# Altium project Zotino.PrjPCB (part 1 of 2)
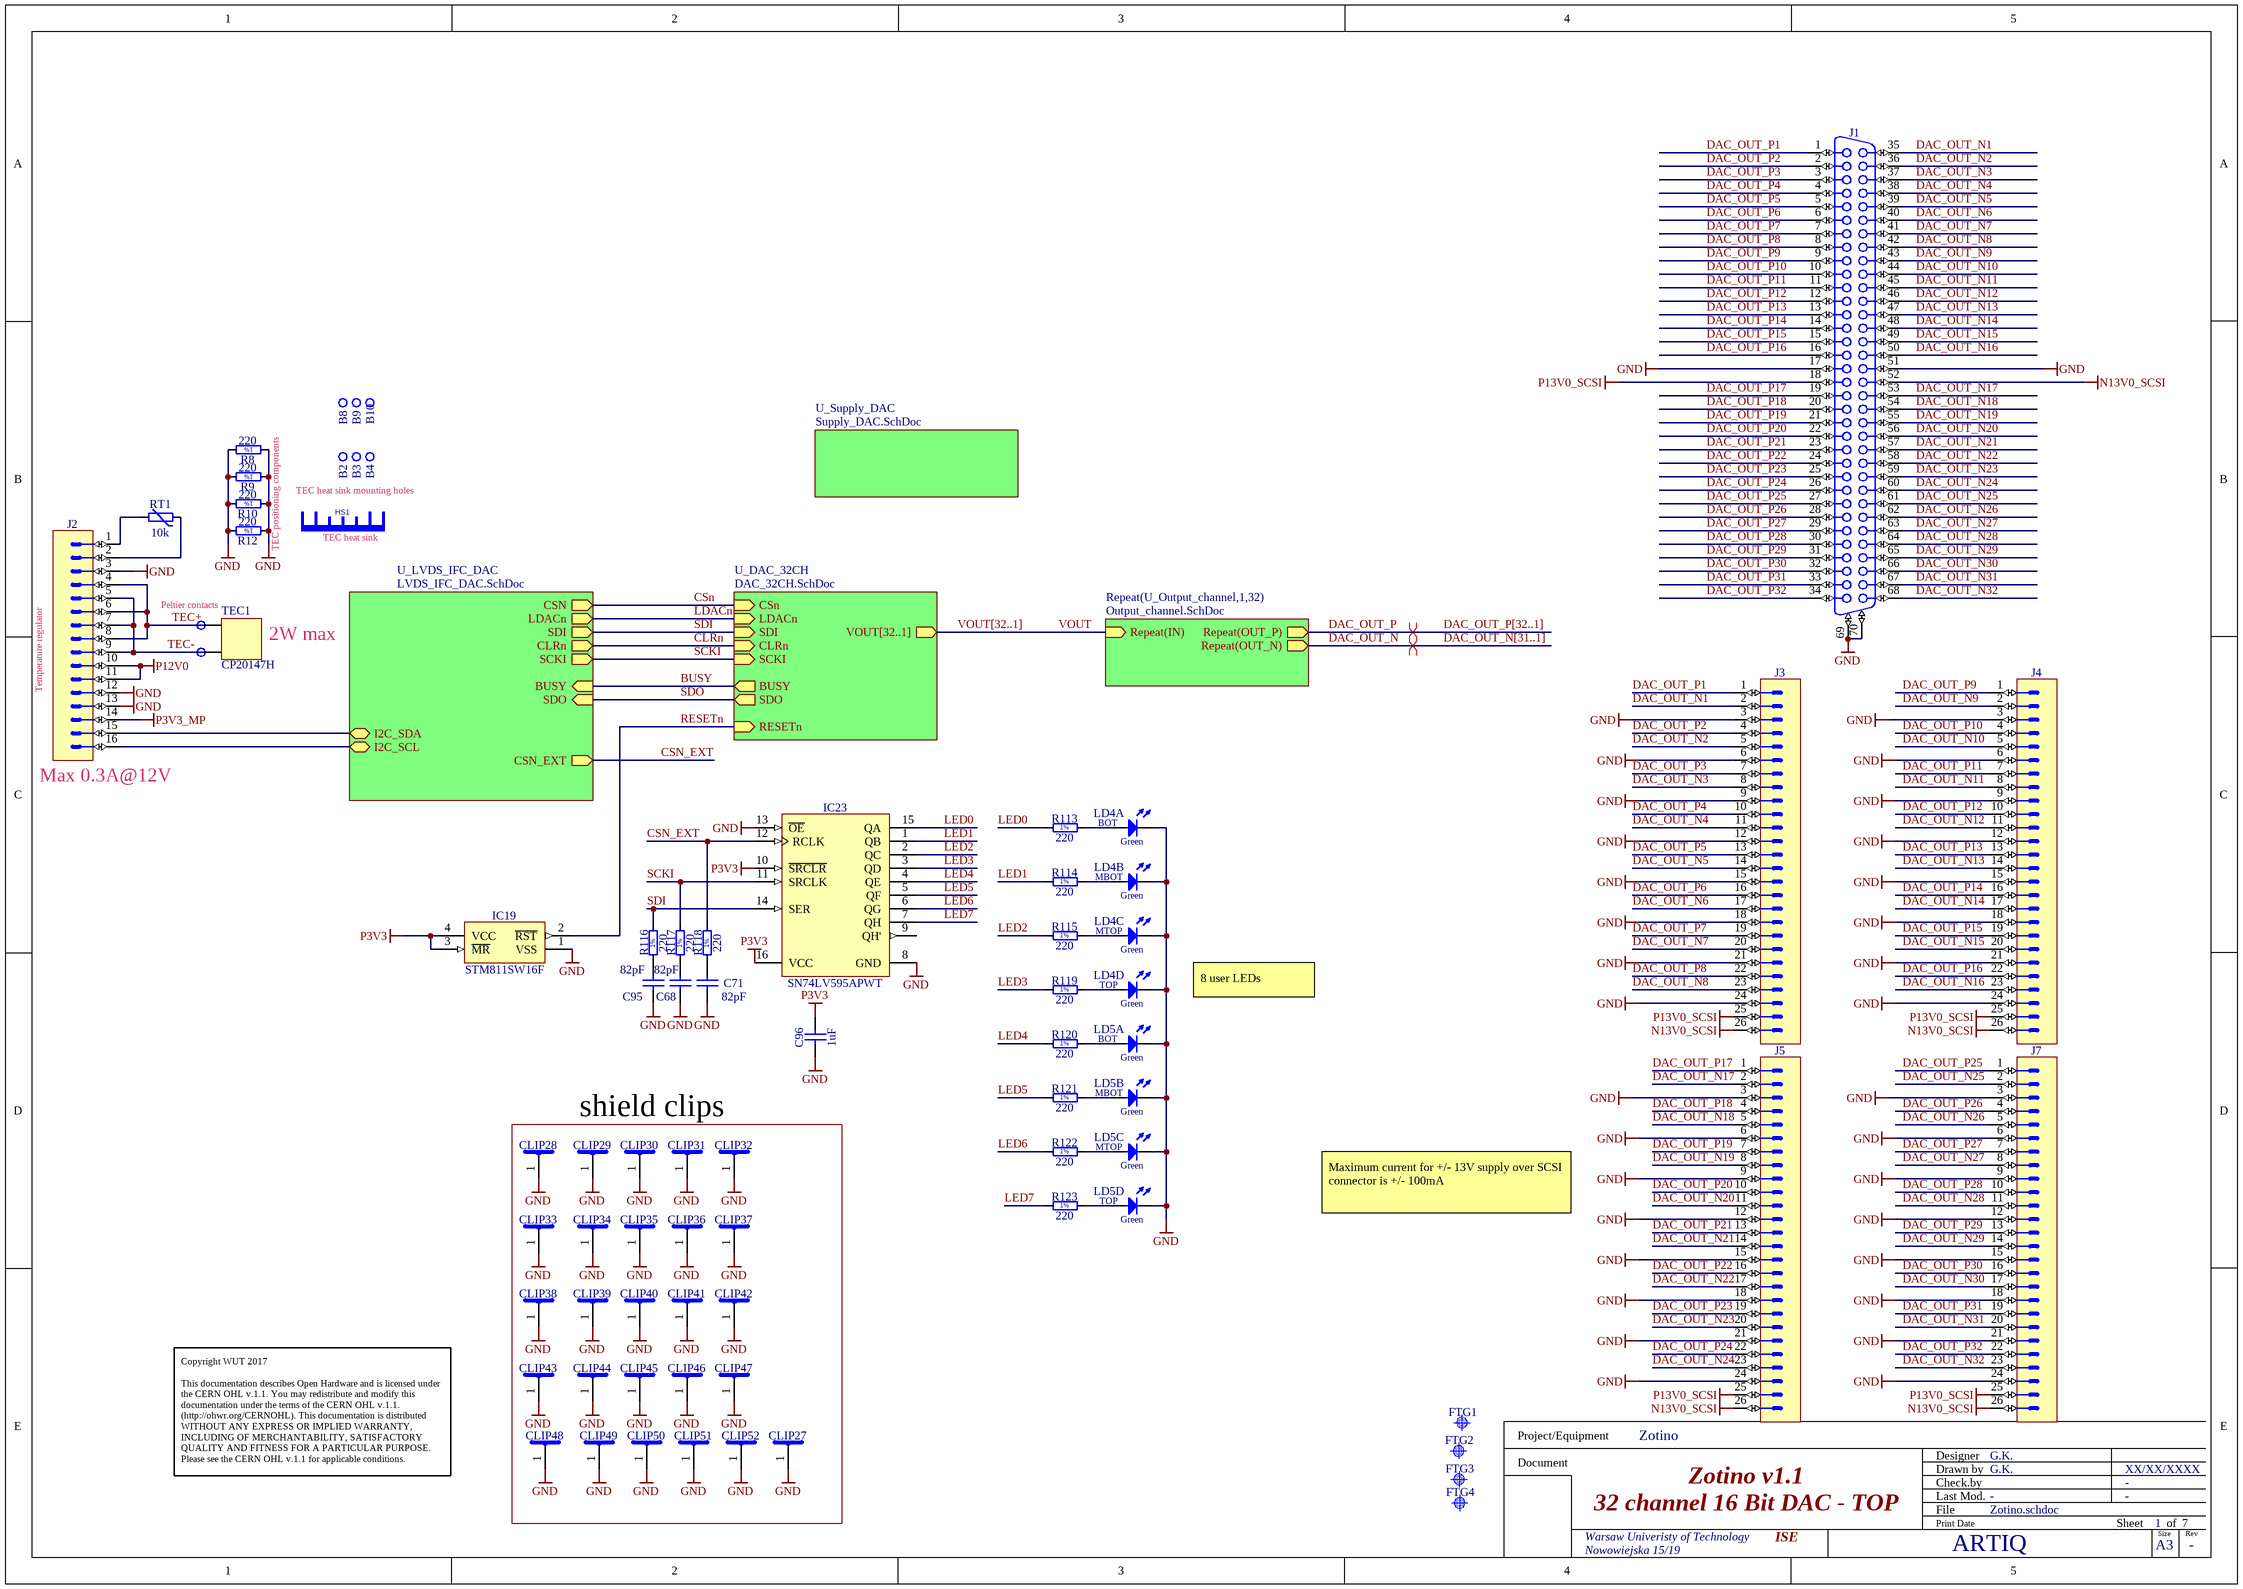
[diagram p0: Zotino.schdoc]
5 sheets, 716 parts. Net scope: hierarchical (ports join the sheet entries above them; power ports are global).
Board file: Zotino.PCBDOC
Sheets:
  Zotino.schdoc
    U_Supply_DAC = Supply_DAC.SchDoc
    U_Output_channel1 = Output_channel.SchDoc
    U_Output_channel2 = Output_channel.SchDoc
    U_Output_channel3 = Output_channel.SchDoc
    U_Output_channel4 = Output_channel.SchDoc
    U_Output_channel5 = Output_channel.SchDoc
    U_Output_channel6 = Output_channel.SchDoc
    U_Output_channel7 = Output_channel.SchDoc
    U_Output_channel8 = Output_channel.SchDoc
    U_Output_channel9 = Output_channel.SchDoc
    U_Output_channel10 = Output_channel.SchDoc
    U_Output_channel11 = Output_channel.SchDoc
    U_Output_channel12 = Output_channel.SchDoc
    U_Output_channel13 = Output_channel.SchDoc
    U_Output_channel14 = Output_channel.SchDoc
    U_Output_channel15 = Output_channel.SchDoc
    U_Output_channel16 = Output_channel.SchDoc
    U_Output_channel17 = Output_channel.SchDoc
    U_Output_channel18 = Output_channel.SchDoc
    U_Output_channel19 = Output_channel.SchDoc
    U_Output_channel20 = Output_channel.SchDoc
    U_Output_channel21 = Output_channel.SchDoc
    U_Output_channel22 = Output_channel.SchDoc
    U_Output_channel23 = Output_channel.SchDoc
    U_Output_channel24 = Output_channel.SchDoc
    U_Output_channel25 = Output_channel.SchDoc
    U_Output_channel26 = Output_channel.SchDoc
    U_Output_channel27 = Output_channel.SchDoc
    U_Output_channel28 = Output_channel.SchDoc
    U_Output_channel29 = Output_channel.SchDoc
    U_Output_channel30 = Output_channel.SchDoc
    U_Output_channel31 = Output_channel.SchDoc
    U_Output_channel32 = Output_channel.SchDoc
    U_DAC_32CH = DAC_32CH.SchDoc
    U_LVDS_IFC_DAC = LVDS_IFC_DAC.SchDoc

## Sheet Zotino.schdoc: Zotino v1.1
size 420 x 297 mm; Author: G.K.; CompanyName: WUT; DrawnBy: G.K.; Organization: WUT ISE; Address1: Warsaw Univeristy of Technology; Address2: Nowowiejska 15/19; DocumentNumber: 1; Revision: -; SheetNumber: 1; SheetTotal: 7; EDA_Number: ARTIQ; Projet: Zotino; ModifiedBy: -; CreateDate: XX/XX/XXXX; CheckedDate: -; Title2: 32 channel 16 Bit DAC - TOP; DivGrp: ISE; Designer: G.K.; ModifiedDate: -; ProjectName: 32 CHANNEL 16bit DAC

### Parts
B2  Plated Hole  [c130h80]  (value not drawn)
B3  Plated Hole  [c130h80]  (value not drawn)
B4  Plated Hole  [c130h80]  (value not drawn)
B5  Plated Hole  [c160h110]  (value not drawn)
B6  Plated Hole  [c160h110]  (value not drawn)
B8  Plated Hole  [c130h80]  (value not drawn)
B9  Plated Hole  [c130h80]  (value not drawn)
B10  Plated Hole  [c130h80]  (value not drawn)
C68  82pF  [CAPC1608X87N]
C71  82pF  [CAPC1608X87N]
C95  82pF  [CAPC1608X87N]
C96  1uF  [CAPC1608X87N]
CLIP27  S1411-46R  [CLIP_HOLLAND-SHIELDING_LC]  (value not drawn)
CLIP28  S1411-46R  [CLIP_HOLLAND-SHIELDING_LC]  (value not drawn)
CLIP29  S1411-46R  [CLIP_HOLLAND-SHIELDING_LC]  (value not drawn)
CLIP30  S1411-46R  [CLIP_HOLLAND-SHIELDING_LC]  (value not drawn)
CLIP31  S1411-46R  [CLIP_HOLLAND-SHIELDING_LC]  (value not drawn)
CLIP32  S1411-46R  [CLIP_HOLLAND-SHIELDING_LC]  (value not drawn)
CLIP33  S1411-46R  [CLIP_HOLLAND-SHIELDING_LC]  (value not drawn)
CLIP34  S1411-46R  [CLIP_HOLLAND-SHIELDING_LC]  (value not drawn)
CLIP35  S1411-46R  [CLIP_HOLLAND-SHIELDING_LC]  (value not drawn)
CLIP36  S1411-46R  [CLIP_HOLLAND-SHIELDING_LC]  (value not drawn)
CLIP37  S1411-46R  [CLIP_HOLLAND-SHIELDING_LC]  (value not drawn)
CLIP38  S1411-46R  [CLIP_HOLLAND-SHIELDING_LC]  (value not drawn)
CLIP39  S1411-46R  [CLIP_HOLLAND-SHIELDING_LC]  (value not drawn)
CLIP40  S1411-46R  [CLIP_HOLLAND-SHIELDING_LC]  (value not drawn)
CLIP41  S1411-46R  [CLIP_HOLLAND-SHIELDING_LC]  (value not drawn)
CLIP42  S1411-46R  [CLIP_HOLLAND-SHIELDING_LC]  (value not drawn)
CLIP43  S1411-46R  [CLIP_HOLLAND-SHIELDING_LC]  (value not drawn)
CLIP44  S1411-46R  [CLIP_HOLLAND-SHIELDING_LC]  (value not drawn)
CLIP45  S1411-46R  [CLIP_HOLLAND-SHIELDING_LC]  (value not drawn)
CLIP46  S1411-46R  [CLIP_HOLLAND-SHIELDING_LC]  (value not drawn)
CLIP47  S1411-46R  [CLIP_HOLLAND-SHIELDING_LC]  (value not drawn)
CLIP48  S1411-46R  [CLIP_HOLLAND-SHIELDING_LC]  (value not drawn)
CLIP49  S1411-46R  [CLIP_HOLLAND-SHIELDING_LC]  (value not drawn)
CLIP50  S1411-46R  [CLIP_HOLLAND-SHIELDING_LC]  (value not drawn)
CLIP51  S1411-46R  [CLIP_HOLLAND-SHIELDING_LC]  (value not drawn)
CLIP52  S1411-46R  [CLIP_HOLLAND-SHIELDING_LC]  (value not drawn)
FTG1  Use only in PCB  [FIDUCIAL_TOP_C100-200]  (value not drawn)
FTG2  Use only in PCB  [FIDUCIAL_TOP_S100-200]  (value not drawn)
FTG3  Use only in PCB  [FIDUCIAL_TOP_S200-400]  (value not drawn)
FTG4  Use only in PCB  [FIDUCIAL_TOP_S100-200]  (value not drawn)
HS1  Heat Sink No Pad  [HSINK_ATS_ATS-X50190G-C1-R0]  (value not drawn)
IC19  STM811SW16F  [SOT143N]
IC23  SN74LV595APWT  [SOP65P640X120-16N]
J1  D-SUB  [TYCO_5787082-7]  (value not drawn)
J2  Header 16  [3M_N2516-6002RB]  (value not drawn)
J3  Header 26  [3M_N2526-6002RB]  (value not drawn)
J4  Header 26  [3M_N2526-6002RB]  (value not drawn)
J5  Header 26  [3M_N2526-6002RB]  (value not drawn)
J7  Header 26  [3M_N2526-6002RB]  (value not drawn)
LD4  Green  [LED_BIVAR_H485CGDL]  (value not drawn)  (parts A,B,C,D of 4)
LD5  Green  [LED_BIVAR_H485CGDL]  (value not drawn)  (parts A,B,C,D of 4)
R8  220  [RESC1608X55N]
R9  220  [RESC1608X55N]
R10  220  [RESC1608X55N]
R12  220  [RESC1608X55N]
R113  220  [RESC1608X55N]
R114  220  [RESC1608X55N]
R115  220  [RESC1608X55N]
R116  220  [RESC1608X55N]
R117  220  [RESC1608X55N]
R118  220  [RESC1608X55N]
R119  220  [RESC1608X55N]
R120  220  [RESC1608X55N]
R121  220  [RESC1608X55N]
R122  220  [RESC1608X55N]
R123  220  [RESC1608X55N]
RT1  10k  [THERMC1608X90N]
TEC1  CP20147H  [TEC_CP20147H]

### Blocks framed on the sheet
shield clips: CLIP27-CLIP52

### Sub-sheets
Repeat(U_Output_channel,1,32) = Output_channel.SchDoc: Repeat(IN) (in), Repeat(OUT_P) (out), Repeat(OUT_N) (out)
U_DAC_32CH = DAC_32CH.SchDoc: CSn (in), LDACn (in), BUSY (out), SDI (in), CLRn (in), SCKI (in), SDO (out), RESETn (in), VOUT[32..1] (out)
U_LVDS_IFC_DAC = LVDS_IFC_DAC.SchDoc: LDACn (out), BUSY (in), CSN (out), SCKI (out), SDI (out), CSN_EXT (out), CLRn (out), SDO (in), I2C_SDA (bidir), I2C_SCL (bidir)
U_Supply_DAC = Supply_DAC.SchDoc: no entries

### Nets
GND: C68.1 C71.1 C95.1 C96.1 CLIP27.1 CLIP28.1 CLIP29.1 CLIP30.1 CLIP31.1 CLIP32.1 CLIP33.1 CLIP34.1 CLIP35.1 CLIP36.1 CLIP37.1 CLIP38.1 CLIP39.1 CLIP40.1 CLIP41.1 CLIP42.1 CLIP43.1 CLIP44.1 CLIP45.1 CLIP46.1 CLIP47.1 CLIP48.1 CLIP49.1 CLIP50.1 CLIP51.1 CLIP52.1 IC19.1(VSS) IC23.8(GND) IC23.13(~{OE}) J1.17 J1.51 J1.69 J1.70 J2.3 J2.12 J2.13 J3.3 J3.6 J3.9 J3.12 J3.15 J3.18 J3.21 J3.24 J4.3 J4.6 J4.9 J4.12 J4.15 J4.18 J4.21 J4.24 J5.3 J5.6 J5.9 J5.12 J5.15 J5.18 J5.21 J5.24 J7.3 J7.6 J7.9 J7.12 J7.15 J7.18 J7.21 J7.24 LD4.1(C) LD4.3(C) LD4.5(C) LD4.7(C) LD5.1(C) LD5.3(C) LD5.5(C) LD5.7(C) R8.1 R8.2 R9.1 R9.2 R10.1 R10.2 R12.1 R12.2
N13V0_SCSI: J1.52 J3.26 J4.26 J5.26 J7.26
P3V3: C96.2 IC19.3(~{MR}) IC19.4(VCC) IC23.10(~{SRCLR}) IC23.16(VCC)
P3V3_MP: J2.14
P12V0: J2.10 J2.11
P13V0_SCSI: J1.18 J3.25 J4.25 J5.25 J7.25
BUSY: sheet U_DAC_32CH/BUSY, sheet U_LVDS_IFC_DAC/BUSY
CLRn: sheet U_DAC_32CH/CLRn, sheet U_LVDS_IFC_DAC/CLRn
CSn: sheet U_DAC_32CH/CSn, sheet U_LVDS_IFC_DAC/CSN
CSN_EXT: IC23.12(RCLK) R118.2 ; sheet U_LVDS_IFC_DAC/CSN_EXT
DAC_OUT_N: sheet Repeat(U_Output_channel,1,32)/Repeat(OUT_N)
DAC_OUT_N1: J1.35 J3.2
DAC_OUT_N2: J1.36 J3.5
DAC_OUT_N3: J1.37 J3.8
DAC_OUT_N4: J1.38 J3.11
DAC_OUT_N5: J1.39 J3.14
DAC_OUT_N6: J1.40 J3.17
DAC_OUT_N7: J1.41 J3.20
DAC_OUT_N8: J1.42 J3.23
DAC_OUT_N9: J1.43 J4.2
DAC_OUT_N10: J1.44 J4.5
DAC_OUT_N11: J1.45 J4.8
DAC_OUT_N12: J1.46 J4.11
DAC_OUT_N13: J1.47 J4.14
DAC_OUT_N14: J1.48 J4.17
DAC_OUT_N15: J1.49 J4.20
DAC_OUT_N16: J1.50 J4.23
DAC_OUT_N17: J1.53 J5.2
DAC_OUT_N18: J1.54 J5.5
DAC_OUT_N19: J1.55 J5.8
DAC_OUT_N20: J1.56 J5.11
DAC_OUT_N21: J1.57 J5.14
DAC_OUT_N22: J1.58 J5.17
DAC_OUT_N23: J1.59 J5.20
DAC_OUT_N24: J1.60 J5.23
DAC_OUT_N25: J1.61 J7.2
DAC_OUT_N26: J1.62 J7.5
DAC_OUT_N27: J1.63 J7.8
DAC_OUT_N28: J1.64 J7.11
DAC_OUT_N29: J1.65 J7.14
DAC_OUT_N30: J1.66 J7.17
DAC_OUT_N31: J1.67 J7.20
DAC_OUT_N32: J1.68 J7.23
DAC_OUT_P: sheet Repeat(U_Output_channel,1,32)/Repeat(OUT_P)
DAC_OUT_P1: J1.1 J3.1
DAC_OUT_P2: J1.2 J3.4
DAC_OUT_P3: J1.3 J3.7
DAC_OUT_P4: J1.4 J3.10
DAC_OUT_P5: J1.5 J3.13
DAC_OUT_P6: J1.6 J3.16
DAC_OUT_P7: J1.7 J3.19
DAC_OUT_P8: J1.8 J3.22
DAC_OUT_P9: J1.9 J4.1
DAC_OUT_P10: J1.10 J4.4
DAC_OUT_P11: J1.11 J4.7
DAC_OUT_P12: J1.12 J4.10
DAC_OUT_P13: J1.13 J4.13
DAC_OUT_P14: J1.14 J4.16
DAC_OUT_P15: J1.15 J4.19
DAC_OUT_P16: J1.16 J4.22
DAC_OUT_P17: J1.19 J5.1
DAC_OUT_P18: J1.20 J5.4
DAC_OUT_P19: J1.21 J5.7
DAC_OUT_P20: J1.22 J5.10
DAC_OUT_P21: J1.23 J5.13
DAC_OUT_P22: J1.24 J5.16
DAC_OUT_P23: J1.25 J5.19
DAC_OUT_P24: J1.26 J5.22
DAC_OUT_P25: J1.27 J7.1
DAC_OUT_P26: J1.28 J7.4
DAC_OUT_P27: J1.29 J7.7
DAC_OUT_P28: J1.30 J7.10
DAC_OUT_P29: J1.31 J7.13
DAC_OUT_P30: J1.32 J7.16
DAC_OUT_P31: J1.33 J7.19
DAC_OUT_P32: J1.34 J7.22
I2C_SCL: J2.16 ; sheet U_LVDS_IFC_DAC/I2C_SCL
I2C_SDA: J2.15 ; sheet U_LVDS_IFC_DAC/I2C_SDA
LDACn: sheet U_DAC_32CH/LDACn, sheet U_LVDS_IFC_DAC/LDACn
LED0: IC23.15(QA) R113.1
LED1: IC23.1(QB) R114.1
LED2: IC23.2(QC) R115.1
LED3: IC23.3(QD) R119.1
LED4: IC23.4(QE) R120.1
LED5: IC23.5(QF) R121.1
LED6: IC23.6(QG) R122.1
LED7: IC23.7(QH) R123.1
RESETn: IC19.2(~{RST}) ; sheet U_DAC_32CH/RESETn
SCKI: IC23.11(SRCLK) R117.2 ; sheet U_DAC_32CH/SCKI, sheet U_LVDS_IFC_DAC/SCKI
SDI: IC23.14(SER) R116.2 ; sheet U_DAC_32CH/SDI, sheet U_LVDS_IFC_DAC/SDI
SDO: sheet U_DAC_32CH/SDO, sheet U_LVDS_IFC_DAC/SDO
TEC+: B5.1 J2.4 J2.6 J2.8
TEC-: B6.1 J2.5 J2.7 J2.9
VOUT: sheet Repeat(U_Output_channel,1,32)/Repeat(IN)
NetC68_2: C68.2 R117.1
NetC71_2: C71.2 R118.1
NetC95_2: C95.2 R116.1
NetJ2_1: J2.1 RT1.1
NetJ2_2: J2.2 RT1.2
NetLD4_2: LD4.2(A) R113.2
NetLD4_4: LD4.4(A) R114.2
NetLD4_6: LD4.6(A) R115.2
NetLD4_8: LD4.8(A) R119.2
NetLD5_2: LD5.2(A) R120.2
NetLD5_4: LD5.4(A) R121.2
NetLD5_6: LD5.6(A) R122.2
NetLD5_8: LD5.8(A) R123.2

Not connected (* = marked no-connect by the designer): B2 1; B3 1; B4 1; B8 1; B9 1; B10 1; IC23 9(QH')

### Buses and harness runs
bus DAC_OUT_N[31..1]
bus DAC_OUT_P[32..1]
bus VOUT[32..1] = sheet U_DAC_32CH/VOUT[32..1]

### Layout directives
differential pair: DAC_OUT_N, DAC_OUT_P

### Notes on the sheet
- TEC heat sink mounting holes
- TEC positioning components
- (near HS1) TEC heat sink
- (near B5) Peltier contacts
- 2W max
- (near J2) Temperature regulator
- (near J2) Max 0.3A@12V
- 8 user LEDs
- Maximum current for +/- 13V supply over SCSI connector is +/- 100mA
- Copyright WUT 2017
  This documentation describes Open Hardware and is licensed under the CERN OHL v.1.1. You may redistribute and modify this documentation under the terms of the CERN OHL v.1.1. (http://ohwr.org/CERNOHL). This documentation is distributed WITHOUT ANY EXPRESS OR IMPLIED WARRANTY, INCLUDING OF MERCHANTABILITY, SATISFACTORY QUALITY AND FITNESS FOR A PARTICULAR PURPOSE. Please see the CERN OHL v.1.1 for applicable conditions.
- Project/Equipment
- Document
- Designer
- Drawn by
- Check.by
- File
- Last Mod.
- Print Date
- Sheet
- Size
- A3
- of
- Rev
- (in symbol LED_BIVAR_H485CGDL, part A) BOT
- (in symbol LED_BIVAR_H485CGDL, part B) MBOT
- (in symbol LED_BIVAR_H485CGDL, part C) MTOP
- (in symbol LED_BIVAR_H485CGDL, part D) TOP
- (in symbol R0603_220R_1%_0.1W_100PPM) 1%

### Library data of the parts
B2-B4 B8-B10 = PLATED_HOLE0.8_PAD1.3: Single Terminal Socket; Part Description: Plated Through Hole: Hole Dia.=0.8mm Pad Dia.=1.3mm, IPC-7251 Level C; Mounted: No; Part Number: PLATED_HOLE0.8_PAD1.3; Component Kind: Standard (No BOM); Component Type: Standard (No BOM); Pin Count: 1; Family: Plated Hole; Socket: No; SMD: No; Sense: No; Status: None; ComponentHeight: 0mm; HelpURL: Undefined; Author: CERN DEM JLC; CreateDate: 30.10.2008; LatestRevisionDate: 30.10.2008; PackageDescription: Plated Through Hole: Hole Dia.=0.8mm Pad Dia.=1.3mm, IPC-7251 Level C
B5 B6 = PLATED_HOLE1.1_PAD1.6: Single Terminal Socket; Part Description: Plated Through Hole: Hole Dia.=1.1mm Pad Dia.=1.6mm, IPC-7251 Level C; Mounted: No; Part Number: PLATED_HOLE1.1_PAD1.6; Component Kind: Standard (No BOM); Component Type: Standard (No BOM); Pin Count: 1; Family: Plated Hole; Socket: No; SMD: No; Sense: No; Status: None; ComponentHeight: 0mm; HelpURL: Undefined; Author: CERN DEM JLC; CreateDate: 30.10.2008; LatestRevisionDate: 30.10.2008; PackageDescription: Plated Through Hole: Hole Dia.=1.1mm Pad Dia.=1.6mm, IPC-7251 Level C
C68 C71 C95 = CC0603_82PF_50V_5%_NP0: Non-polarised capacitor; Part Description: SMD Multilayer Chip Ceramic Capacitor; Manufacturer: GENERIC; Manufacturer1 Part Number: 223886715829; Voltage: 50V; TC: C0G/NP0; Tolerance: ±5%; Part Number: CC0603_82PF_50V_5%_NP0; Component Kind: Standard; Component Type: Standard; Pin Count: 2; Value: 82pF; Status: Preferred; Manufacturer Part Number: CC0603_82PF_50V_5%_NP0; Case: 0603; Mounted: Yes; Socket: No; SMD: Yes; Sense: No; Manufacturer1 Example: PHYCOMP; Manufacturer1 ComponentHeight: 0.87mm; HelpURL: \\cern.ch\dfs\Applications\Altium\Datasheets\CC0603_NP0_PHYCOMP.pdf; Author: CERN DEM JLC; CreateDate: 03.12.2007; LatestRevisionDate: 03.12.2007
C96 = CC0603_1UF_25V_10%_X7R: Non-polarised capacitor; Part Description: SMD Multilayer Chip Ceramic Capacitor; Manufacturer: GENERIC; Manufacturer1 Part Number: GRM188R71E105KA12D; Voltage: 25V; TC: X7R; Tolerance: ±10%; Part Number: CC0603_1UF_25V_10%_X7R; Component Kind: Standard; Component Type: Standard; Pin Count: 2; Value: 1uF; Status: None; Manufacturer Part Number: CC0603_1UF_25V_10%_X7R; Case: 0603; Mounted: Yes; Socket: No; SMD: Yes; Sense: No; Manufacturer1 Example: MURATA; Manufacturer1 ComponentHeight: 0.9mm; HelpURL: \\cern.ch\dfs\Applications\Altium\Datasheets\CC0603_X7R_MURATA.pdf; Author: CERN DEM JLC; CreateDate: 18.01.2011; LatestRevisionDate: 18.01.2011
CLIP27-CLIP52 = SHIELD_CLIP: Surface Mount Clip for PCB Screening Covers; Part Description: Surface Mount Clip for PCB Screening Covers, 1500 Serie; Manufacturer: HARWIN; PressFit: No; Table: Metal Screening Box; Part Number: S1411-46R; Component Kind: Standard; Component Type: Standard; Pin Count: 1; PackageDescription: Surface Mount Clip for PCB Screening Covers, 1500 Serie; Mounted: Yes; Socket: No; SMD: Yes; Status: None; Manufacturer Part Number: S1411-46R; ComponentHeight: 3.5mm; HelpURL: \\cern.ch\dfs\Applications\Altium\Datasheets\CLIP_HOLLAND-SHIELDING_LC.pdf; Author: CERN DEM JLC; CreateDate: 2013-06-25; LatestRevisionDate: 2013-06-25
FTG1 = FIDUCIAL_TARGET_C100-200: Fiducial Target; Part Description: Round Fiducial Target, Top Layer, 1.0mm, Top Solder 2.0mm, Keepout =2.0mm; Mounted: No; Part Number: FIDUCIAL_TARGET_C100-200; Component Kind: Standard (No BOM); Component Type: Standard (No BOM); Pin Count: 1; Family: Fiducial; Socket: No; SMD: Yes; Sense: No; Status: None; ComponentHeight: 0mm; HelpURL: Undefined; Author: CERN DEM JLC; CreateDate: 09.02.2010; LatestRevisionDate: 04.04.2012; PackageDescription: Round Fiducial Target, Top Layer, 1.0mm, Top Solder 2.0mm, Keepout =2.0mm
FTG2 FTG4 = FIDUCIAL_TARGET_S100-200: Fiducial Target; Part Description: Square Fiducial Target, Top Layer, 1.0mm, Top Solder 2.0mm, Keepout =2.0mm; Mounted: No; Part Number: FIDUCIAL_TARGET_S100-200; Component Kind: Standard (No BOM); Component Type: Standard (No BOM); Pin Count: 1; Family: Fiducial; Socket: No; SMD: Yes; Sense: No; Status: None; ComponentHeight: 0mm; HelpURL: Undefined; Author: CERN DEM JLC; CreateDate: 09.02.2010; LatestRevisionDate: 04.04.2012; PackageDescription: Square Fiducial Target, Top Layer, 1.0mm, Top Solder 2.0mm, Keepout =2.0mm
FTG3 = FIDUCIAL_TARGET_S200-400: Fiducial Target; Part Description: Square Fiducial Target, Top Layer, 2.0mm, Top Solder 4.0mm, Keepout =4.0mm; Mounted: No; Part Number: FIDUCIAL_TARGET_S200-400; Component Kind: Standard (No BOM); Component Type: Standard (No BOM); Pin Count: 1; Family: Fiducial; Socket: No; SMD: Yes; Sense: No; Status: None; ComponentHeight: 0mm; HelpURL: Undefined; Author: CERN DEM JLC; CreateDate: 02.06.2008; LatestRevisionDate: 04.04.2012; PackageDescription: Square Fiducial Target, Top Layer, 2.0mm, Top Solder 4.0mm, Keepout =4.0mm
HS1 = HEAT_SINK_19x19: Heat Sink Without Pad; Part Description: 35.0 x 35.0 x 7.5 mm BGA Heat Sink - High Performance  maxiFLOW/maxiGRIP-STD; Manufacturer: ADVENCED THERMAL SOLUTION (ATS); Manufacturer Part Number: ATS-X50190G-C1-R0; PressFit: No; Part Number: HSINK_ATS_ATS-X50190G-C1-R0; Component Kind: Standard; Component Type: Standard; Pin Count: 0; PackageDescription: 19 x 19 x 12.5 mm BGA Heat Sink, Body 34.8mm x 19mm  Height 12.5mm; Mounted: Yes; Socket: No; SMD: No; Sense: No; Status: None; ComponentHeight: 12.5mm; HelpURL: \\cern.ch\dfs\Applications\Altium\Datasheets\HSINK_ATS_ATS-50350B-C1-R0.pdf; Author: GK; CreateDate: 30.11.2016; LatestRevisionDate: 30.11.2016
IC19 = STM811SW16F: Microprocessor Reset Circuit; Part Description: 2.93V Reset Threshold Voltage Microprocessor Reset Circuit; Manufacturer: ST MICROELECTRONICS; PressFit: No; Bonding: No; Part Number: STM811SW16F; Component Kind: Standard; Component Type: Standard; Device: STM811SW16F; PackageDescription: SOT143, 4-Leads, Body 3.0x2.6mm (max), Pitch 1.92mm, IPC Medium Density; Manufacturer Part Number: STM811SW16F; Pin Count: 4; Case: SOT143; Mounted: Yes; Socket: No; SMD: Yes; Sense: No; ComponentHeight: 1.12mm; Author: CERN DEM JLC; HelpURL: \\cern.ch\dfs\Applications\Altium\Datasheets\STM811SW16F.pdf; CreateDate: 17.11.2016; LatestRevisionDate: 17.11.2016
IC23 = SN74LV595APWT: 8-Bit Shift Register With 3-State Output Register; Manufacturer: TEXAS INSTRUMENTS; PressFit: No; Bonding: No; Part Number: SN74LV595APWT; Component Kind: Standard; Component Type: Standard; Device: SN74LV595APWT; PackageDescription: SOP, 0.65mm pitch; 16 pin, 4.40mm W X 5.00mm L X 1.20mm H body IPC Medium Density; Part Description: 8-Bit Shift Register With 3-State Output Register; Manufacturer Part Number: SN74LV595APWT; Pin Count: 16; Case: TSSOP16; Mounted: Yes; Socket: No; SMD: Yes; Sense: No; ComponentHeight: 1.2mm; Author: CERN DEM JLC; HelpURL: \\cern.ch\dfs\Applications\Altium\Datasheets\SN74LV595APWT.pdf; CreateDate: 10.05.2012; LatestRevisionDate: 10.05.2012
J1 = TYCO_5787082-7: 68 contacts, AMPLIMITE .050", Right Angled Receptacle Series III; Manufacturer: TYCO ELECTRONICS; PressFit: No; Part Number: TYCO_5787082-7; Component Kind: Standard; Component Type: Standard; Pin Count: 70; Family: D-SUB; Mounted: Yes; Socket: No; SMD: No; Sense: No; Status: None; Part Description: 68 contacts, AMPLIMITE .050", Right Angled Receptacle Series III; Manufacturer Part Number: 5787082-7; ComponentHeight: 9.5mm; HelpURL: \\cern.ch\dfs\Applications\Altium\Datasheets\TYCO_5787082-7.pdf; Author: CERN DEM JLC; CreateDate: 13.03.2017; LatestRevisionDate: 13.03.2017
J2 = 3M_N2516-6002RB: Connector 16 Male; Part Description: 16 Contacts - Straight .100'' x .100'' Low Profile Four-Wall Header, 2500 Series; Manufacturer: 3M; PressFit: No; Part Number: 3M_N2516-6002RB; Component Kind: Standard; Component Type: Standard; Pin Count: 16; Family: Header 16; Mounted: Yes; Socket: No; SMD: No; Sense: No; Status: None; Manufacturer Part Number: N2516-6002RB; ComponentHeight: 10.03mm; HelpURL: \\cern.ch\dfs\Applications\Altium\Datasheets\3M_N2516-6002RB.pdf; Author: CERN DEM JLC; CreateDate: 11.02.2009; LatestRevisionDate: 11.08.2009
J3-J5 J7 = 3M_N2526-6002RB: Connector 26 Male; Part Description: 26 Contacts - Straight .100'' x .100'' Low Profile Four-Wall Header, 2500 Series; Manufacturer: 3M; PressFit: No; Part Number: 3M_N2526-6002RB; Component Kind: Standard; Component Type: Standard; Pin Count: 26; Family: Header 26; Mounted: Yes; Socket: No; SMD: No; Sense: No; Status: None; Manufacturer Part Number: N2526-6002RB; ComponentHeight: 10.03mm; HelpURL: \\cern.ch\dfs\Applications\Altium\Datasheets\3M_N2526-6002RB.pdf; Author: CERN DEM JLC; CreateDate: 11.02.2009; LatestRevisionDate: 11.08.2009
LD4 LD5 = LED_BIVAR_H485CGDL: LED x4 Green 1C2A-BOT_3C4A_5C6A_7C8A-TOP; Part Description: Quad-Level 2mm Green LED, PCB Edge Mounting; Manufacturer: BIVAR; PressFit: No; Bonding: No; Part Number: LED_BIVAR_H485CGDL; Component Kind: Standard; Component Type: Standard; Color: Green; PackageDescription: Quad-Level 2mm Green, PCB Edge Mounting  BIVAR H485CHDL; Manufacturer Part Number: H485CGDL; Pin Count: 8; Mounted: Yes; Socket: No; SMD: No; Sense: No; ComponentHeight: 11.3mm; HelpURL: \\cern.ch\dfs\Applications\Altium\Datasheets\LED_BIVAR_H485CGDL.pdf; Author: CERN DEM JLC; CreateDate: 04.06.2012; LatestRevisionDate: 04.06.2012
R8-R10 R12 R113-R123 = R0603_220R_1%_0.1W_100PPM: Resistor - 1%; Part Description: General Purpose Thick Film Chip Resistor; Manufacturer: GENERIC; Manufacturer1 Part Number: NRC06F2200TRF; Power: 0.1W; TC: ±100ppm/°C; Part Number: R0603_220R_1%_0.1W_100PPM; Component Kind: Standard; Component Type: Standard; Pin Count: 2; Value: 220; Status: Preferred; Tolerance: ±1%; Manufacturer Part Number: R0603_220R_1%_0.1W_100PPM; Case: 0603; Mounted: Yes; Sense: No; Socket: No; SMD: Yes; Manufacturer1 Example: NIC COMPONENT; Manufacturer1 ComponentHeight: 0.55mm; HelpURL: \\cern.ch\dfs\Applications\Altium\Datasheets\R0603_NIC_NRC.pdf; Author: CERN DEM JLC; CreateDate: 03.12.2007; LatestRevisionDate: 13.03.2008
RT1 = THERM_NTC_10K_EPCOS_B57330V2103J260: Thermistor NTC (Negative Temperature Coefficient); Part Description: SMD NTC Thermistor for Temperature Measurement; Manufacturer: EPCOS; Power: 180mW; Tolerance: ±5%; Part Number: THERM_NTC_10K_EPCOS_B57330V2103J260; Component Kind: Standard; Component Type: Standard; Pin Count: 2; Value: 10k; Status: None; Manufacturer Part Number: B57330V2103J260; Case: 0603; Mounted: Yes; Socket: No; SMD: Yes; Sense: No; ComponentHeight: 0.9mm; HelpURL: \\cern.ch\dfs\Applications\Altium\Datasheets\THERM_EPCOS_B573xxV2.pdf; Author: CERN DEM BC; CreateDate: 30.07.2015; LatestRevisionDate: 30.07.2015
TEC1 = TEC_CP20147H: Peltier Module 15x15 mm

## Sheet Supply_DAC.SchDoc: Zotino
size 420 x 297 mm; Author: G.K.; CompanyName: WUT; DrawnBy: G.K.; Organization: WUT ISE; Address1: Warsaw Univeristy of Technology; Address2: Nowowiejska 15/19; DocumentNumber: 5; Revision: -; SheetNumber: 5; SheetTotal: 7; EDA_Number: ARTIQ; Projet: Zotino; ModifiedBy: -; CreateDate: XX/XX/XXXX; CheckedDate: -; Title2: Power supply v1.1; DivGrp: ISE; Designer: G.K.; ModifiedDate: -; ProjectName: 32 CHANNEL 16bit DAC
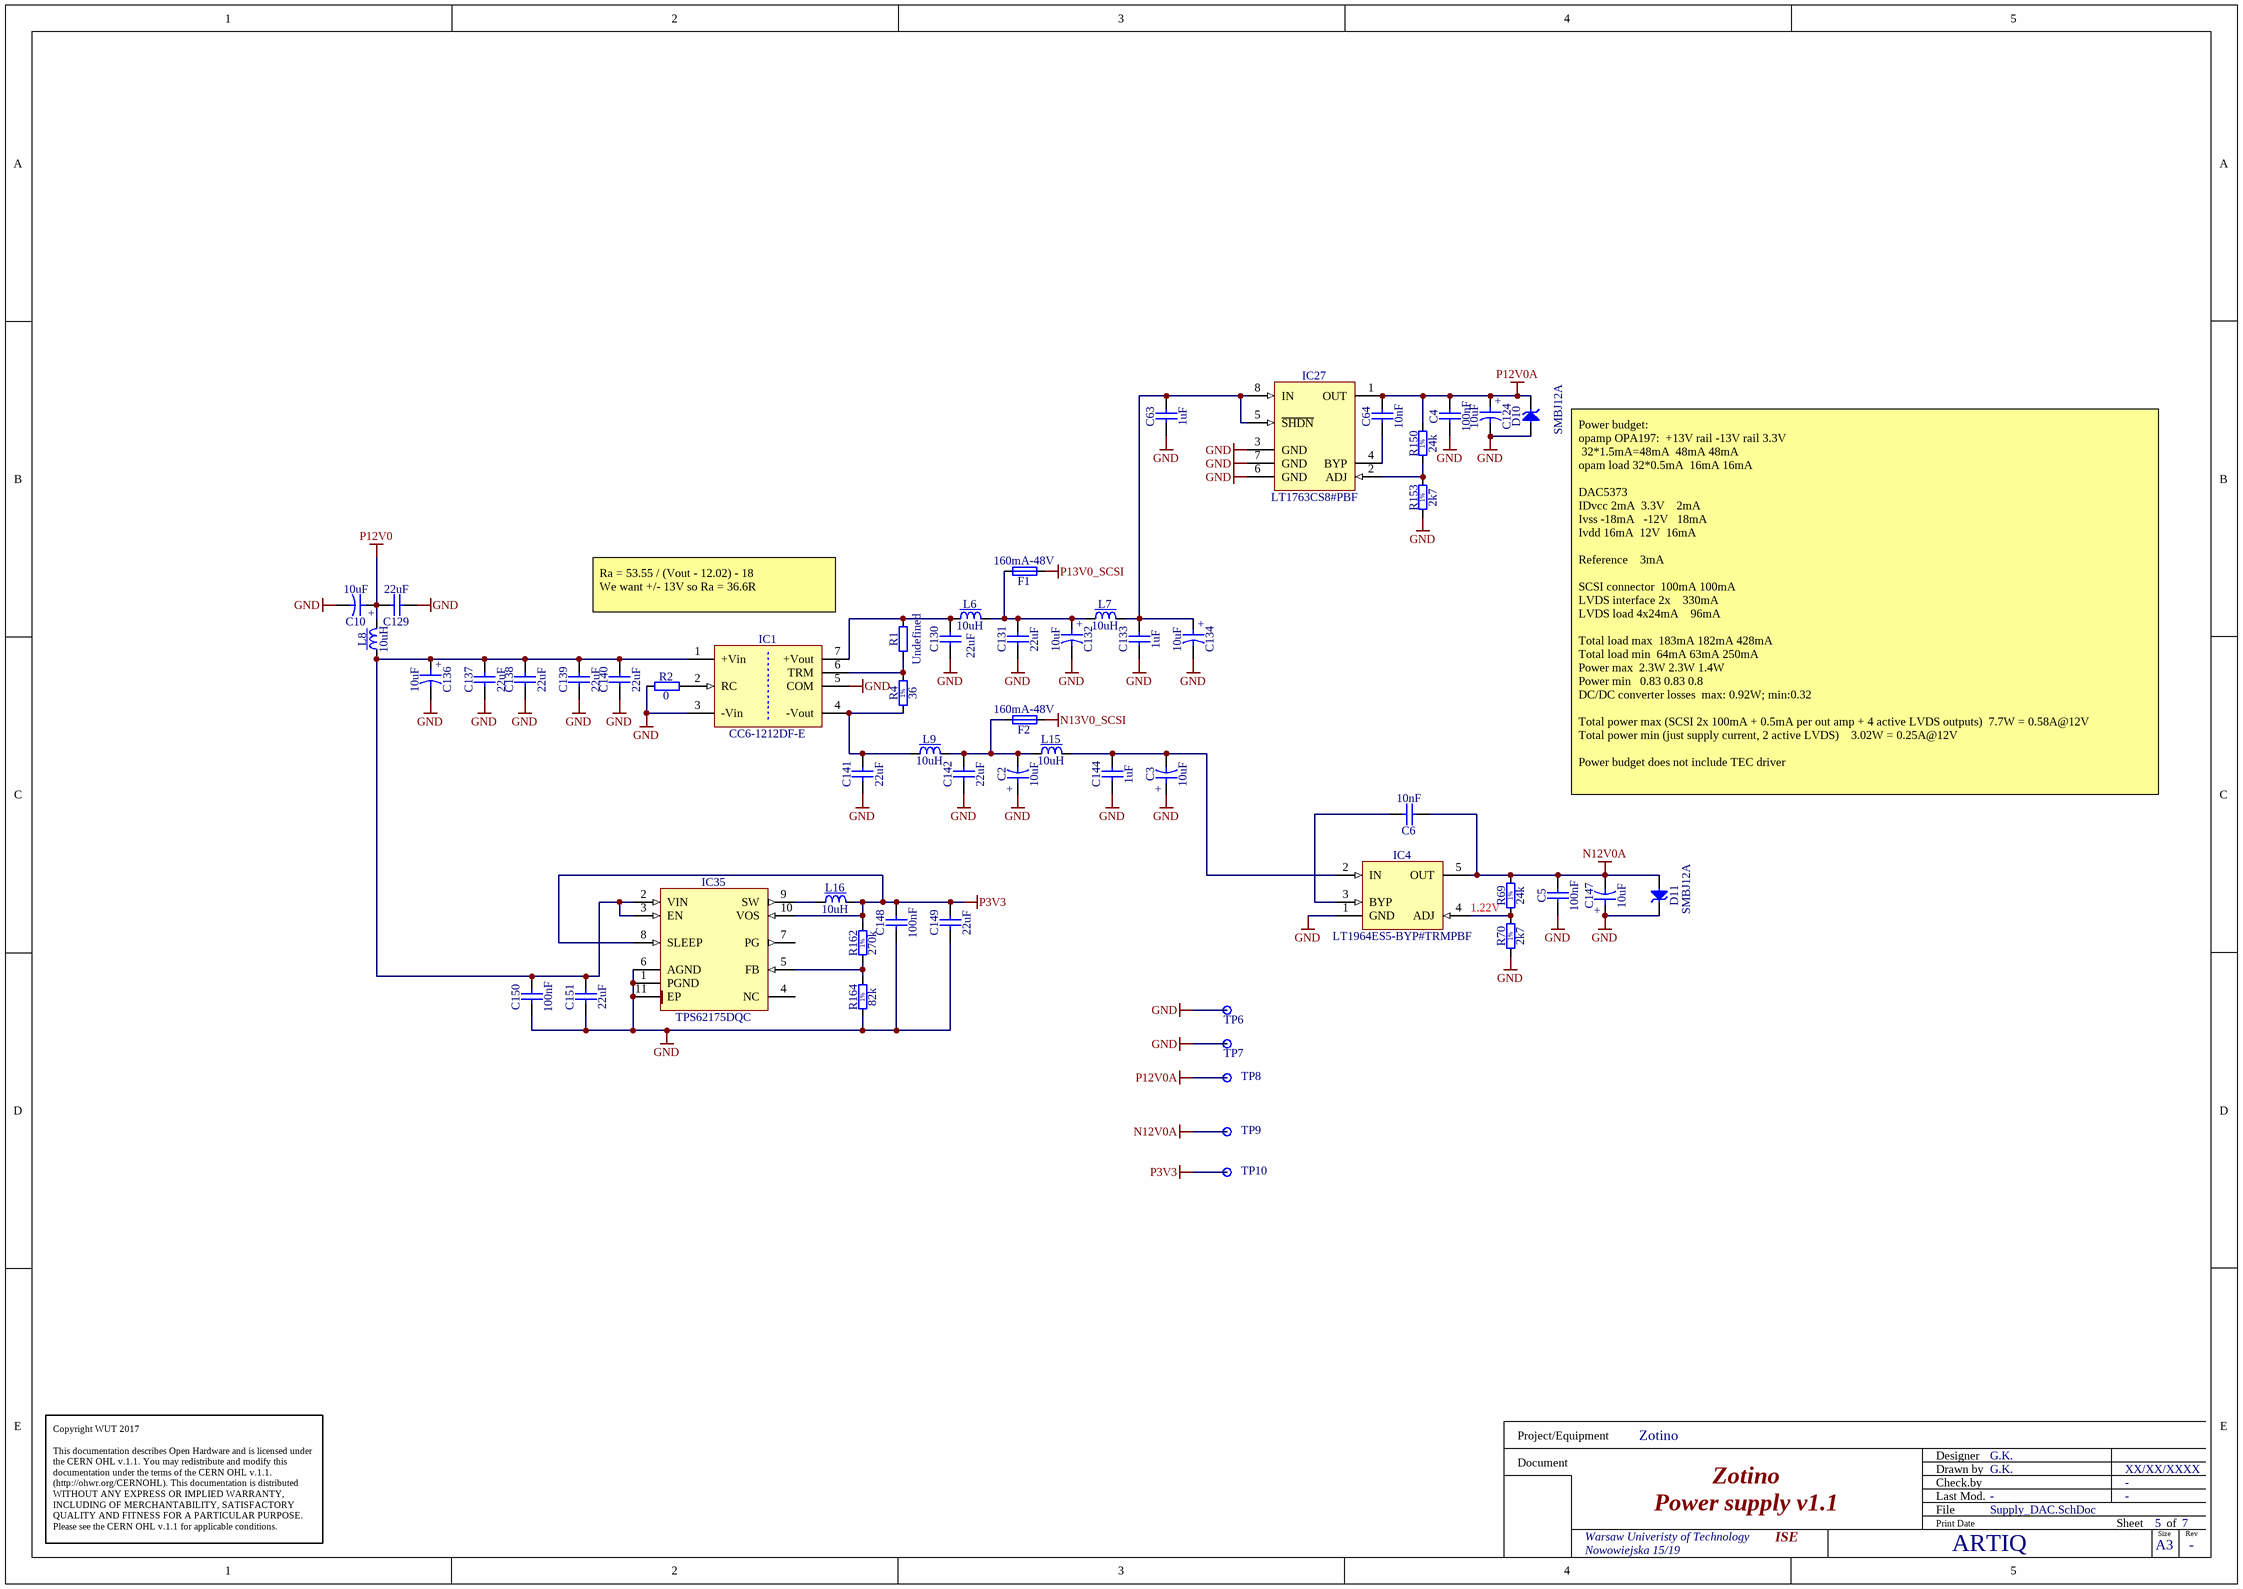
[diagram p1: Supply_DAC.SchDoc]

### Parts
C2  10uF  [CAPMP3216X180N]
C3  10uF  [CAPMP3216X180N]
C4  100nF  [CAPC1005X55N]
C5  100nF  [CAPC1005X55N]
C6  10nF  [CAPC1608X87N]
C10  10uF  [CAPMP3216X180N]
C63  1uF  [CAPC1608X87N]
C64  10nF  [CAPC1608X87N]
C124  10uF  [CAPMP3216X180N]
C129  22uF  [CAPC2012X135N]
C130  22uF  [CAPC2012X135N]
C131  22uF  [CAPC2012X135N]
C132  10uF  [CAPMP3216X180N]
C133  1uF  [CAPC1608X87N]
C134  10uF  [CAPMP3216X180N]
C136  10uF  [CAPMP3216X180N]
C137  22uF  [CAPC2012X135N]
C138  22uF  [CAPC2012X135N]
C139  22uF  [CAPC2012X135N]
C140  22uF  [CAPC2012X135N]
C141  22uF  [CAPC2012X135N]
C142  22uF  [CAPC2012X135N]
C144  1uF  [CAPC1608X87N]
C147  10uF  [CAPMP3216X180N]
C148  100nF  [CAPC1005X55N]
C149  22uF  [CAPC2012X135N]
C150  100nF  [CAPC1005X55N]
C151  22uF  [CAPC2012X135N]
D10  SMBJ12A  [DIOM5336X265N]
D11  SMBJ12A  [DIOM5336X265N]
F1  160mA-48V  [FUSRC3216X100N]
F2  160mA-48V  [FUSRC3216X100N]
IC1  CC6-1212DF-E  [CC6-1212DF-E]
IC4  LT1964ES5-BYP#TRMPBF  [SOT95P280X100-5N]
IC27  LT1763CS8#PBF  [SOIC127P600X175-8N]
IC35  TPS62175DQC  [SON50P200X300X80-11N-R94X250]
L6  10uH  [IND_MURATA-PS_8400]
L7  10uH  [IND_MURATA-PS_8400]
L8  10uH  [IND_MURATA-PS_8400]
L9  10uH  [IND_MURATA-PS_8400]
L15  10uH  [IND_MURATA-PS_8400]
L16  10uH  [IND_MURATA-PS_8400]
R1  Undefined  [RESC1608X55N]
R2  0  [RESC1005X40N]
R4  36  [RESC1608X55N]
R69  24k  [RESC1608X55N]
R70  2k7  [RESC1608X55N]
R150  24k  [RESC1608X55N]
R153  2k7  [RESC1608X55N]
R162  270k  [RESC1608X55N]
R164  82k  [RESC1608X55N]
TP6  Test Point  [TPS127]  (value not drawn)
TP7  Test Point  [TPS127]  (value not drawn)
TP8  Test Point  [TPS127]  (value not drawn)
TP9  Test Point  [TPS127]  (value not drawn)
TP10  Test Point  [TPS127]  (value not drawn)

### Nets
GND: C2.1 C3.1 C4.1 C5.1 C10.2 C63.1 C124.2 C129.1 C130.1 C131.1 C132.2 C133.1 C134.2 C136.2 C137.1 C138.1 C139.1 C140.1 C141.1 C142.1 C144.1 C147.1 C148.1 C149.1 C150.1 C151.1 D10.2(A) D11.1(C) IC1.3(-Vin) IC1.5(COM) IC4.1(GND) IC27.3(GND) IC27.6(GND) IC27.7(GND) IC35.1(PGND) IC35.6(AGND) IC35.11(EP) R2.1 R70.1 R153.1 R164.1 TP6.1 TP7.1
N12V0A: C5.2 C6.1 C147.2 D11.2(A) IC4.5(OUT) R69.2 TP9.1
N13V0_SCSI: F2.1
P3V3: C148.2 C149.2 IC35.8(SLEEP) IC35.10(VOS) L16.2 R162.2 TP10.1
P12V0: C10.1 C129.2 L8.2
P12V0A: C4.2 C64.2 C124.1 D10.1(C) IC27.1(OUT) R150.2 TP8.1
P13V0_SCSI: F1.1
NetC2_2: C2.2 C142.2 F2.2 L9.2 L15.1
NetC3_2: C3.2 C144.2 IC4.2(IN) L15.2
NetC6_2: C6.2 IC4.3(BYP)
NetC63_2: C63.2 C133.2 C134.1 IC27.5(~{SHDN}) IC27.8(IN) L7.2
NetC64_1: C64.1 IC27.4(BYP)
NetC130_2: C130.2 IC1.7(+Vout) L6.1 R1.2
NetC131_2: C131.2 C132.1 F1.2 L6.2 L7.1
NetC136_1: C136.1 C137.2 C138.2 C139.2 C140.2 C150.2 C151.2 IC1.1(+Vin) IC35.2(VIN) IC35.3(EN) L8.1
NetC141_2: C141.2 IC1.4(-Vout) L9.1 R4.1
NetIC1_2: IC1.2(RC) R2.2
NetIC1_6: IC1.6(TRM) R1.1 R4.2
NetIC4_4: IC4.4(ADJ) R69.1 R70.2
NetIC27_2: IC27.2(ADJ) R150.1 R153.2
NetIC35_5: IC35.5(FB) R162.1 R164.2
NetIC35_9: IC35.9(SW) L16.1

Not connected (* = marked no-connect by the designer): IC35 4(NC) 7(PG)

### Notes on the sheet
- Ra = 53.55 / (Vout - 12.02) - 18
  We want +/- 13V so Ra = 36.6R
- (near D10) Power budget:
  opamp OPA197:		+13V rail	-13V rail	3.3V
  32*1.5mA=48mA		48mA	48mA
  opam load	32*0.5mA		16mA	16mA
  DAC5373
  IDvcc 2mA  3.3V				2mA
  Ivss -18mA   -12V			18mA
  Ivdd 16mA  12V		16mA
  Reference 			3mA
  SCSI connector		100mA	100mA
  LVDS interface 2x				330mA
  LVDS load 4x24mA				96mA
  Total load	max		183mA	182mA	428mA
  Total load min		64mA	63mA	250mA
  Power max		2.3W	2.3W	1.4W
  Power min			0.83	0.83	0.8
  DC/DC converter losses 	max: 0.92W; min:0.32
  Total power max (SCSI 2x 100mA + 0.5mA per out amp + 4 active LVDS outputs) 	7.7W = 0.58A@12V
  Total power min (just supply current, 2 active LVDS)				3.02W = 0.25A@12V
  Power budget does not include TEC driver
- 1.22V
- Copyright WUT 2017
  This documentation describes Open Hardware and is licensed under the CERN OHL v.1.1. You may redistribute and modify this documentation under the terms of the CERN OHL v.1.1. (http://ohwr.org/CERNOHL). This documentation is distributed WITHOUT ANY EXPRESS OR IMPLIED WARRANTY, INCLUDING OF MERCHANTABILITY, SATISFACTORY QUALITY AND FITNESS FOR A PARTICULAR PURPOSE. Please see the CERN OHL v.1.1 for applicable conditions.
- Project/Equipment
- Document
- Designer
- Drawn by
- Check.by
- File
- Last Mod.
- Print Date
- Sheet
- Size
- A3
- of
- Rev
- (in symbol CTE3216-18_10UF_16V_20%_AVX_TCJ) +
- (in symbol R0603_2K7_1%_0.1W_100PPM) 1%
- (in symbol R0603_24K_1%_0.1W_100PPM) 1%
- (in symbol R0603_36R_1%_0.1W_100PPM) 1%
- (in symbol R0603_82K_1%_0.1W_100PPM) 1%
- (in symbol R0603_270K_1%_0.1W_100PPM) 1%

### Library data of the parts
C2 C3 C10 C124 C132 C134 C136 C147 = CTE3216-18_10UF_16V_20%_AVX_TCJ: Polarised capacitor; Part Description: ESR 0R200 Tantalum Solid Electrolytic Chip Capacitor with Conductive Polymer Electrode; Manufacturer: AVX; Manufacturer Part Number: TCJA106M016R0200; Voltage: 16V; Tolerance: ±20%; Part Number: CTE3216-18_10UF_16V_20%_AVX_TCJ; Component Kind: Standard; Component Type: Standard; Pin Count: 2; Value: 10uF; Status: Preferred; Case: A; Mounted: Yes; Socket: No; SMD: Yes; Sense: No; ComponentHeight: 1.8mm; HelpURL: \\cern.ch\dfs\Applications\Altium\Datasheets\CTE_AVX_TCJ.pdf; Author: CERN DEM JLC; CreateDate: 29.03.2012; LatestRevisionDate: 29.03.2012
C4 C5 C148 C150 = CC0402_100NF_16V_10%_X5R: Non-polarised capacitor; Part Description: SMD Multilayer Chip Ceramic Capacitor; Manufacturer: GENERIC; Manufacturer1 Part Number: GRM155R61C104KA88D; Voltage: 16V; TC: X5R; Tolerance: ±10%; Part Number: CC0402_100NF_16V_10%_X5R; Component Kind: Standard; Component Type: Standard; Pin Count: 2; Value: 100nF; Status: None; Manufacturer Part Number: CC0402_100NF_16V_10%_X5R; Case: 0402; Mounted: Yes; Socket: No; SMD: Yes; Sense: No; Manufacturer1 Example: MURATA; Manufacturer1 ComponentHeight: 0.55mm; HelpURL: \\cern.ch\dfs\Applications\Altium\Datasheets\CC0402_X5R_MURATA_GRM.pdf; Author: CERN DEM JLC; CreateDate: 10.12.2013; LatestRevisionDate: 10.12.2013
C6 C64 = CC0603_10NF_50V_10%_X7R: Non-polarised capacitor; Part Description: SMD Multilayer Chip Ceramic Capacitor; Manufacturer: GENERIC; Manufacturer1 Part Number: 223858615636; Voltage: 50V; TC: X7R; Tolerance: ±10%; Part Number: CC0603_10NF_50V_10%_X7R; Component Kind: Standard; Component Type: Standard; Pin Count: 2; Value: 10nF; Status: Preferred; Manufacturer Part Number: CC0603_10NF_50V_10%_X7R; Case: 0603; Mounted: Yes; Socket: No; SMD: Yes; Sense: No; Manufacturer1 Example: PHYCOMP; Manufacturer1 ComponentHeight: 0.87mm; HelpURL: \\cern.ch\dfs\Applications\Altium\Datasheets\CC0603_X7R_PHYCOMP.pdf; Author: CERN DEM JLC; CreateDate: 03.12.2007; LatestRevisionDate: 03.12.2007
C63 C133 C144 = CC0603_1UF_25V_10%_X7R: as C96 on sheet Zotino; Part Number: CC0603_1UF_25V_10%_X7R; Component Kind: Standard; Component Type: Standard; Pin Count: 2; Value: 1uF; Status: None; Manufacturer Part Number: CC0603_1UF_25V_10%_X7R; Case: 0603; Mounted: Yes; Socket: No; SMD: Yes; Sense: No; Manufacturer1 Example: MURATA; Manufacturer1 ComponentHeight: 0.9mm; HelpURL: \\cern.ch\dfs\Applications\Altium\Datasheets\CC0603_X7R_MURATA.pdf; Author: CERN DEM JLC; CreateDate: 18.01.2011; LatestRevisionDate: 18.01.2011
C129-C131 C137-C142 C149 C151 = CC0805_22UF_16V_10%_X5R: Non-polarised capacitor; Part Description: SMD Multilayer Chip Ceramic Capacitor; Manufacturer: GENERIC; Manufacturer1 Part Number: C2012X5R1C226KT; Voltage: 16V; TC: X5R; Tolerance: ±10%; Part Number: CC0805_22UF_16V_10%_X5R; Component Kind: Standard; Component Type: Standard; Pin Count: 2; Value: 22uF; Status: Preferred; Manufacturer Part Number: CC0805_22UF_16V_10%_X5R; Case: 0805; Mounted: Yes; Socket: No; SMD: Yes; Sense: No; Manufacturer1 Example: TDK; Manufacturer1 ComponentHeight: 1.35mm; HelpURL: \\cern.ch\dfs\Applications\Altium\Datasheets\CC0805_X5R_TDK_C.pdf; Author: CERN DEM JLC; CreateDate: 25.10.2012; LatestRevisionDate: 25.10.2012
D10 D11 = SMBJ12A: Zener Diode; Part Description: Uni-Directional Transient Voltage Suppressor Diode; Manufacturer: FAIRCHILD SEMICONDUCTOR; Voltage: 12V; Power: 600W; PressFit: No; Bonding: No; Part Number: SMBJ12A; Component Kind: Standard; Component Type: Standard; Device: SMBJ12A; PackageDescription: DO-214-AA/SMB Diode, Molded Body; 5.34mm L X 3.625mm W X 2.65mm H, IPC Medium Density; Manufacturer Part Number: SMBJ12A; Pin Count: 2; Case: DO-214AA; Mounted: Yes; Socket: No; SMD: Yes; Sense: No; ComponentHeight: 2.65mm; HelpURL: \\cern.ch\dfs\Applications\Altium\Datasheets\SMBJ.pdf; Author: CERN DEM JLC; CreateDate: 10.04.2013; LatestRevisionDate: 10.04.2013
F1 F2 = FUSR1206_TYCO-NANOSMD016F: Fuse; Part Description: PolySwitch® PTC Overcurrent Protection Device; Manufacturer: TYCO ELECTRONICS; Manufacturer Part Number: nanoSMDC016F; PressFit: No; Part Number: FUSR1206_TYCO-NANOSMD016F; Component Kind: Standard; Component Type: Standard; Pin Count: 2; PackageDescription: Chip Resettable Fuse, 2-Leads, Body 3.2mmx1.6mm, IPC Medium Density; Family: Fuses Resettable; Mounted: Yes; Socket: No; SMD: Yes; Sense: No; Value: 160mA-48V; ComponentHeight: 1mm; HelpURL: \\cern.ch\dfs\Applications\Altium\Datasheets\FUSR_TYCO_NanoSMD016F.pdf; Author: CERN DEM JLC; CreateDate: 03.07.2008; LatestRevisionDate: 04.08.2008
IC1 = DC/DC_CC6-1212DF-E: CONV DC/DC 6W DUAL 12V +-12V PCB; Manufacturer: TDK-Lambda Americas Inc.; PressFit: No; Bonding: No; Part Number: CC6-1212DF-E; Component Kind: Standard; Component Type: Standard; Device: CC6-1212DF-E; PackageDescription: CC6 Series, Body 0.900 x 0.831 x 0.335, Regulated; Part Description: CONV DC/DC 6W DUAL 12V +-12V PCB; Manufacturer Part Number: CC6-1212DF-E; Pin Count: 7; Mounted: Yes; Socket: No; SMD: No; Sense: No; ComponentHeight: 10.45mm; Author: GK; CreateDate: 17.12.2016; LatestRevisionDate: 17.12.2016
IC4 = LT1964ES5-BYP#TRMPBF: 200mA, Low Noise, Low Dropout Negative Micropower Regulator; Part Description: -1.22V to -20V, 200mA, Low Noise, Low Dropout Negative Micropower Regulator; Manufacturer: LINEAR TECHNOLOGY; PressFit: No; Bonding: No; Part Number: LT1964ES5-BYP#TRMPBF; Component Kind: Standard; Component Type: Standard; Device: LT1964ES5-BYP#TRMPBF; PackageDescription: SOT23, 0.95mm pitch; 5 pin, 1.75mm W X 3.00mm L, IPC Medium Density; Manufacturer Part Number: LT1964ES5-BYP#TRMPBF; Pin Count: 5; Case: SOT23-5; Mounted: Yes; Socket: No; SMD: Yes; Sense: No; ComponentHeight: 1mm; HelpURL: \\cern.ch\dfs\Applications\Altium\Datasheets\LT1964ES5-BYP#TRMPBF.pdf; Author: CERN DEM MR; CreateDate: 17.02.2016; LatestRevisionDate: 17.02.2016
IC27 = LT1763CS8#PBF: 1.22V to 20V 500mA, Low Noise, LDO Adjustable Micropower Regulator; Manufacturer: LINEAR TECHNOLOGY; PressFit: No; Bonding: No; Part Number: LT1763CS8#PBF; Component Kind: Standard; Component Type: Standard; Device: LT1763CS8#PBF; PackageDescription: SOIC 8, Pitch 1.27mm, Body 4x5mm, IPC Medium Density; Part Description: 1.22V to 20V 500mA, Low Noise, LDO Adjustable Micropower Regulator; Manufacturer Part Number: LT1763CS8#PBF; Pin Count: 8; Case: SOIC8; Mounted: Yes; Socket: No; SMD: Yes; Sense: No; ComponentHeight: 1.75mm; HelpURL: \\cern.ch\dfs\Applications\Altium\Datasheets\LT1763CS8#PBF.pdf; Author: CERN DEM JLC; CreateDate: 11.01.2010; LatestRevisionDate: 11.01.2010
IC35 = TPS62175DQC: 4.75-28VDC to 1-6VDC, 500mA Step-Down Converter With Sleep Mode; Manufacturer: TEXAS INSTRUMENTS; PressFit: No; Bonding: No; Part Number: TPS62175DQC; Component Kind: Standard; Component Type: Standard; Device: TPS62175DQC; PackageDescription: SON, 10-Leads, Body 2x3mm, Pitch 0.5mm, Thermal Pad 0.94x2.5mm, IPC Medium Density; Part Description: 4.75-28VDC to 1-6VDC, 500mA Step-Down Converter With Sleep Mode; Manufacturer Part Number: TPS62175DQC; Pin Count: 11; Case: SON10; Mounted: Yes; Socket: No; SMD: Yes; Sense: No; ComponentHeight: 0.8mm; HelpURL: \\cern.ch\dfs\Applications\Altium\Datasheets\TPS62175DQC.pdf; Author: CERN DEM JMW; CreateDate: 11.08.2015; LatestRevisionDate: 11.08.2015
L6-L9 L15 L16 = IND_10UH_10%_MURATA-PS_8400: Inductor With Core; Part Description: Miniature Surface Mount Power Inductor (8400 Serie); Manufacturer: MURATA POWER SOLUTIONS; Manufacturer Part Number: 84103C; Power: 950mA; Resistance: 0.24R; Tolerance: ±10%; Part Number: IND_10UH_10%_MURATA-PS_8400; Component Kind: Standard; Component Type: Standard; Pin Count: 2; Value: 10uH; Status: None; Mounted: Yes; Socket: No; SMD: Yes; Sense: No; ComponentHeight: 2.9mm; HelpURL: \\cern.ch\dfs\Applications\Altium\Datasheets\IND_MURATA-PS_8400.pdf; Author: CERN DEM JLC; CreateDate: 02.07.2012; LatestRevisionDate: 02.07.2012
R1 = R0603_NO-VALUE: Resistor; Part Description: Reserved Footprint For a 0603 (1608) Chip Resistor; Mounted: No; Part Number: R0603_NO-VALUE; Component Kind: Standard; Component Type: Standard; Pin Count: 2; Value: Undefined; Status: None; Manufacturer: Undefined; Manufacturer Part Number: R0603_NO-VALUE; Case: 0603; Sense: No; Socket: No; SMD: Yes; Manufacturer1 Example: Undefined; Manufacturer1 Part Number: Undefined; Manufacturer1 ComponentHeight: Undefined; HelpURL: Undefined; Author: CERN DEM JLC; CreateDate: 03.12.2007; LatestRevisionDate: 13.03.2008
R2 = R0402_0R_JUMPER: Resistor; Part Description: 1A (0.05R Max DC Resistance) Zero Ohm Jumper; Manufacturer: GENERIC; Manufacturer1 Part Number: 232270591001L; Part Number: R0402_0R_JUMPER; Component Kind: Standard; Component Type: Standard; Pin Count: 2; Value: 0; Status: Not recommended; Manufacturer Part Number: R0402_0R_JUMPER; Case: 0402; Mounted: Yes; Sense: No; Socket: No; SMD: Yes; Manufacturer1 Example: YAGEO PHYCOMP; Manufacturer1 ComponentHeight: 0.4mm; HelpURL: \\cern.ch\dfs\Applications\Altium\Datasheets\R0402_Phycomp_RC0402.pdf; Author: CERN DEM JLC; CreateDate: 03.12.2007; LatestRevisionDate: 17.10.2012
R4 = R0603_36R_1%_0.1W_100PPM: Resistor - 1%; Part Description: General Purpose Thick Film Chip Resistor; Manufacturer: GENERIC; Manufacturer1 Part Number: NRC06F36R0TRF; Power: 0.1W; TC: ±100ppm/°C; Part Number: R0603_36R_1%_0.1W_100PPM; Component Kind: Standard; Component Type: Standard; Pin Count: 2; Value: 36; Status: Preferred; Tolerance: ±1%; Manufacturer Part Number: R0603_36R_1%_0.1W_100PPM; Case: 0603; Mounted: Yes; Sense: No; Socket: No; SMD: Yes; Manufacturer1 Example: NIC COMPONENT; Manufacturer1 ComponentHeight: 0.55mm; HelpURL: \\cern.ch\dfs\Applications\Altium\Datasheets\R0603_NIC_NRC.pdf; Author: CERN DEM JLC; CreateDate: 03.12.2007; LatestRevisionDate: 13.03.2008
R69 R150 = R0603_24K_1%_0.1W_100PPM: Resistor - 1%; Part Description: General Purpose Thick Film Chip Resistor; Manufacturer: GENERIC; Manufacturer1 Part Number: NRC06F2402TRF; Power: 0.1W; TC: ±100ppm/°C; Part Number: R0603_24K_1%_0.1W_100PPM; Component Kind: Standard; Component Type: Standard; Pin Count: 2; Value: 24k; Status: Preferred; Tolerance: ±1%; Manufacturer Part Number: R0603_24K_1%_0.1W_100PPM; Case: 0603; Mounted: Yes; Sense: No; Socket: No; SMD: Yes; Manufacturer1 Example: NIC COMPONENT; Manufacturer1 ComponentHeight: 0.55mm; HelpURL: \\cern.ch\dfs\Applications\Altium\Datasheets\R0603_NIC_NRC.pdf; Author: CERN DEM JLC; CreateDate: 03.12.2007; LatestRevisionDate: 13.03.2008
R70 R153 = R0603_2K7_1%_0.1W_100PPM: Resistor - 1%; Part Description: General Purpose Thick Film Chip Resistor; Manufacturer: GENERIC; Manufacturer1 Part Number: RC0603FR-072K7L; Power: 0.1W; TC: ±100ppm/°C; Part Number: R0603_2K7_1%_0.1W_100PPM; Component Kind: Standard; Component Type: Standard; Pin Count: 2; Value: 2k7; Status: Preferred; Tolerance: ±1%; Manufacturer Part Number: R0603_2K7_1%_0.1W_100PPM; Case: 0603; Mounted: Yes; Sense: No; Socket: No; SMD: Yes; Manufacturer1 Example: YAGEO PHYCOMP; Manufacturer1 ComponentHeight: 0.55mm; HelpURL: \\cern.ch\dfs\Applications\Altium\Datasheets\R0603_PHYCOMP_RC0603.pdf; Author: CERN DEM JLC; CreateDate: 02.05.2011; LatestRevisionDate: 02.05.2011
R162 = R0603_270K_1%_0.1W_100PPM: Resistor - 1%; Part Description: General Purpose Thick Film Chip Resistor; Manufacturer: GENERIC; Manufacturer1 Part Number: NRC06F2703TRF; Power: 0.1W; TC: ±100ppm/°C; Part Number: R0603_270K_1%_0.1W_100PPM; Component Kind: Standard; Component Type: Standard; Pin Count: 2; Value: 270k; Status: Preferred; Tolerance: ±1%; Manufacturer Part Number: R0603_270K_1%_0.1W_100PPM; Case: 0603; Mounted: Yes; Sense: No; Socket: No; SMD: Yes; Manufacturer1 Example: NIC COMPONENT; Manufacturer1 ComponentHeight: 0.55mm; HelpURL: \\cern.ch\dfs\Applications\Altium\Datasheets\R0603_NIC_NRC.pdf; Author: CERN DEM JLC; CreateDate: 03.12.2007; LatestRevisionDate: 13.03.2008
R164 = R0603_82K_1%_0.1W_100PPM: Resistor - 1%; Part Description: General Purpose Thick Film Chip Resistor; Manufacturer: GENERIC; Manufacturer1 Part Number: NRC06F8202TRF; Power: 0.1W; TC: ±100ppm/°C; Part Number: R0603_82K_1%_0.1W_100PPM; Component Kind: Standard; Component Type: Standard; Pin Count: 2; Value: 82k; Status: Preferred; Tolerance: ±1%; Manufacturer Part Number: R0603_82K_1%_0.1W_100PPM; Case: 0603; Mounted: Yes; Sense: No; Socket: No; SMD: Yes; Manufacturer1 Example: NIC COMPONENT; Manufacturer1 ComponentHeight: 0.55mm; HelpURL: \\cern.ch\dfs\Applications\Altium\Datasheets\R0603_NIC_NRC.pdf; Author: CERN DEM JLC; CreateDate: 03.12.2007; LatestRevisionDate: 13.03.2008
TP6-TP10 = SMD_PAD_1.27X1.27MM: Part Description: 1.27mm x 1.27mm PCB Copper Area (SMD Test Point); Mounted: No; Part Number: SMD_PAD_1.27X1.27MM; Component Kind: Standard (No BOM); Component Type: Standard (No BOM); Pin Count: 1; Family: Test Point; Socket: No; SMD: Yes; Sense: No; Status: None; ComponentHeight: 0mm; HelpURL: Undefined; Author: CERN DEM JLC; CreateDate: 12.01.2008; LatestRevisionDate: 12.01.2008; PackageDescription: 1.27mm x 1.27mm PCB Copper Area (SMD Test Point)